# EAGLE design tiny-usb (EAGLE 6.5.0)
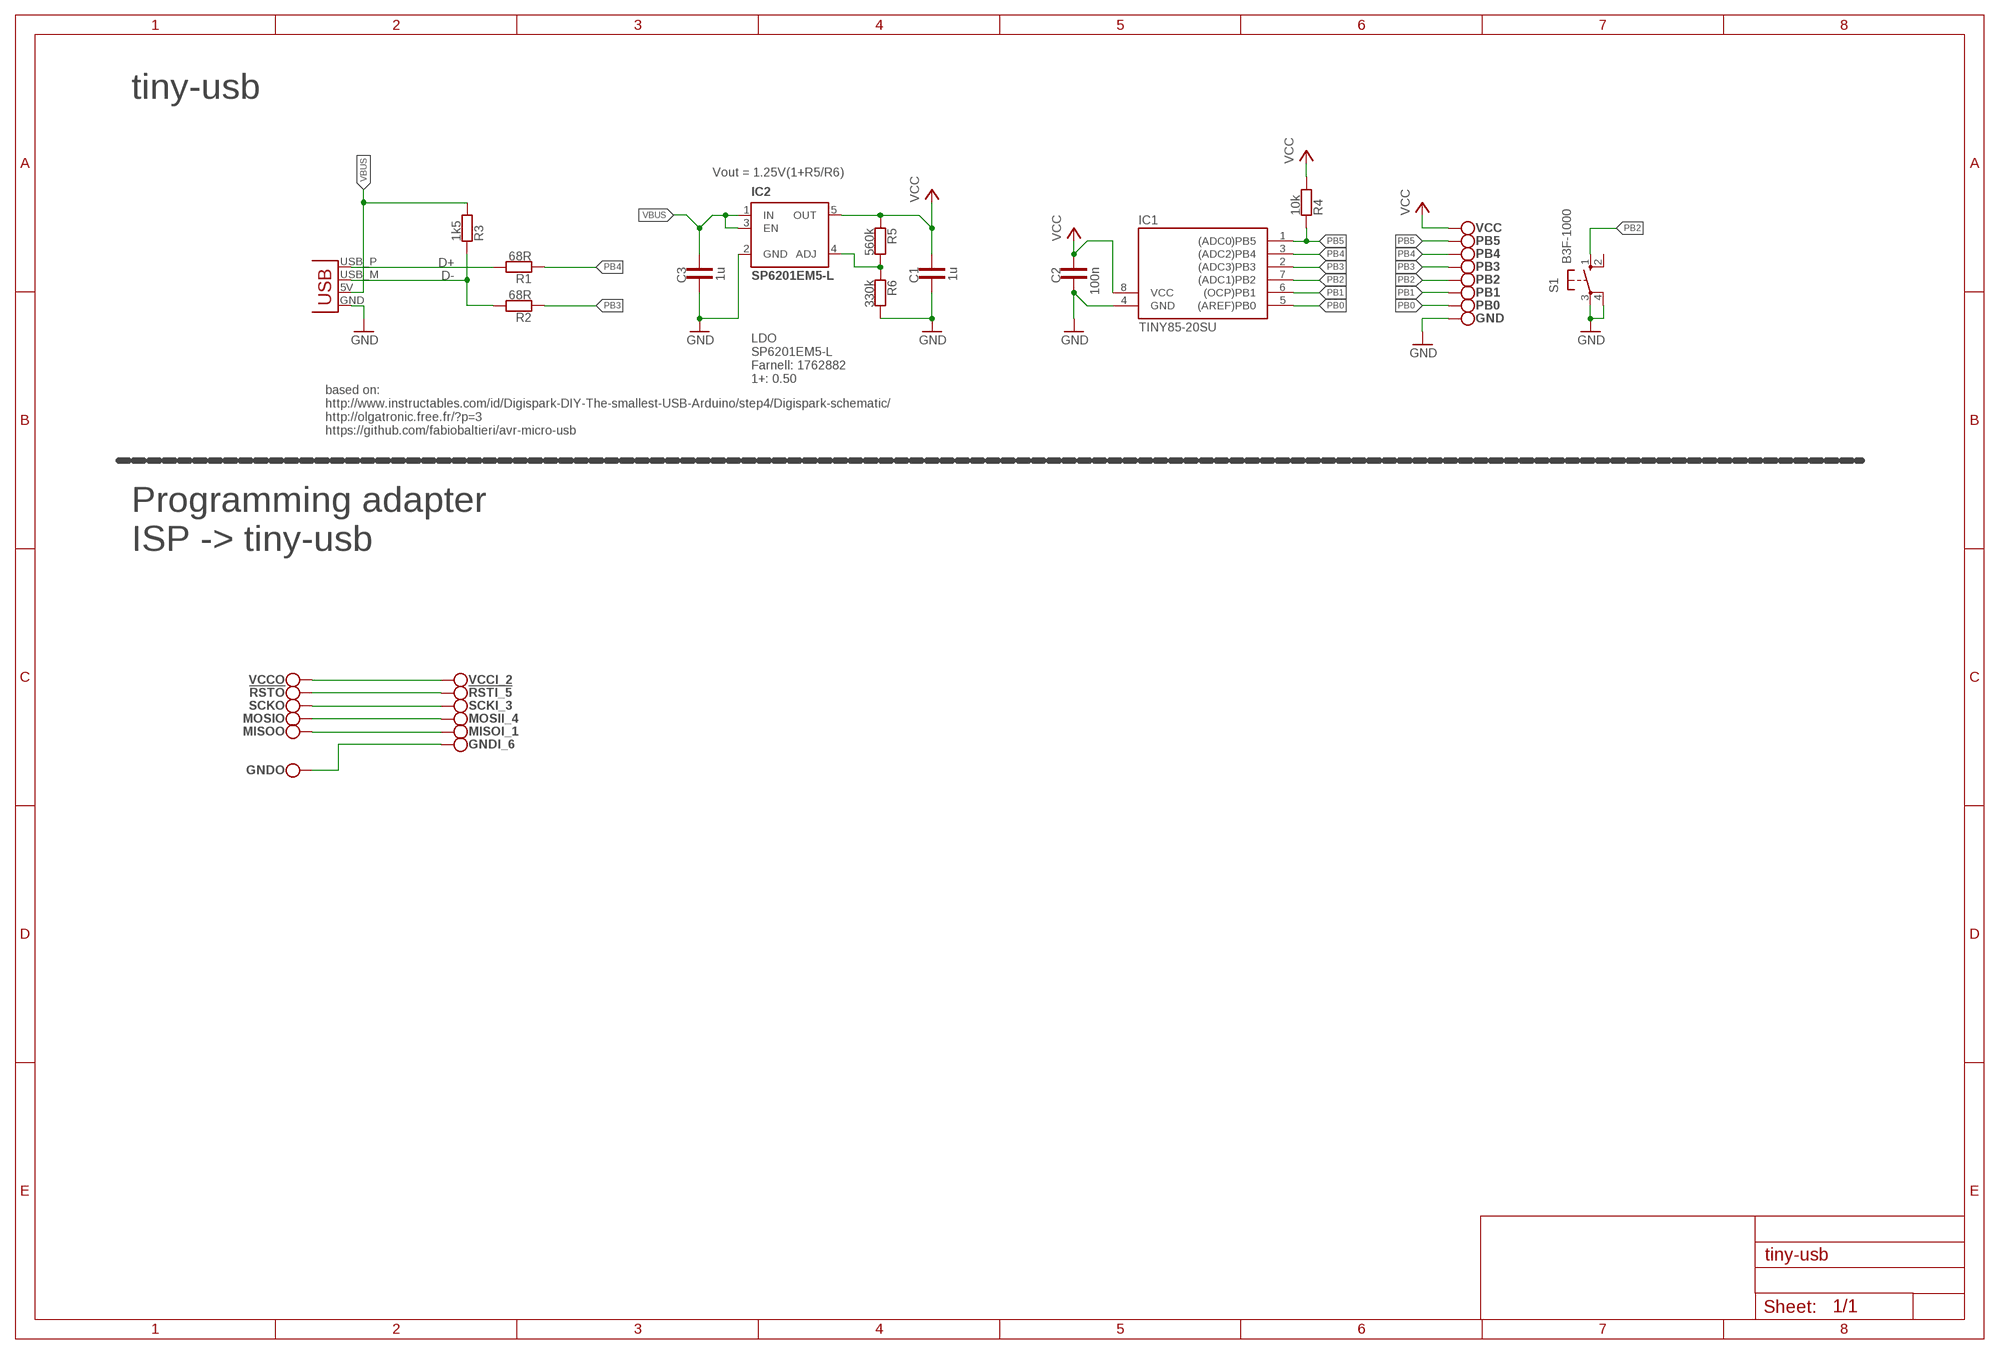
[diagram p0: schematic, sheet 1]

## Parts
!RSTI_5  TP_Q3X1.5MM  [PAD_Q1.5X3MM]
!RSTO  TP_Q3X1.5MM  [PAD_Q1.5X3MM]
C1  1u  C0603  [0603MIL]
C2  100n  C0603  [0603MIL]
C3  1u  C0603  [0603MIL]
GND  TP_Q3X1.5MM  [PAD_Q1.5X3MM]
GNDI_6  TP_Q3X1.5MM  [PAD_Q1.5X3MM]
GNDO  TP_Q3X1.5MM  [PAD_Q1.5X3MM]
IC1  TINY85-20SU  TINY25-20SU  [SOIC8]
IC2  SP6201EM5-L  [SOT23-5]
MISOI_1  TP_Q3X1.5MM  [PAD_Q1.5X3MM]
MISOO  TP_Q3X1.5MM  [PAD_Q1.5X3MM]
MOSII_4  TP_Q3X1.5MM  [PAD_Q1.5X3MM]
MOSIO  TP_Q3X1.5MM  [PAD_Q1.5X3MM]
PB0  TP_Q3X1.5MM  [PAD_Q1.5X3MM]
PB1  TP_Q3X1.5MM  [PAD_Q1.5X3MM]
PB2  TP_Q3X1.5MM  [PAD_Q1.5X3MM]
PB3  TP_Q3X1.5MM  [PAD_Q1.5X3MM]
PB4  TP_Q3X1.5MM  [PAD_Q1.5X3MM]
PB5  TP_Q3X1.5MM  [PAD_Q1.5X3MM]
R1  68R  R0603  [0603MIL]
R2  68R  R0603  [0603MIL]
R3  1k5  R0603  [0603MIL]
R4  10k  R0603  [0603MIL]
R5  560k  R0603  [0603MIL]
R6  330k  R0603  [0603MIL]
S1  B3F-1000  10-XXSMD  [B3F-10SMD]
SCKI_3  TP_Q3X1.5MM  [PAD_Q1.5X3MM]
SCKO  TP_Q3X1.5MM  [PAD_Q1.5X3MM]
VCC  TP_Q3X1.5MM  [PAD_Q1.5X3MM]
VCCI_2  TP_Q3X1.5MM  [PAD_Q1.5X3MM]
VCCO  TP_Q3X1.5MM  [PAD_Q1.5X3MM]
X1  USBPCB  [USB-A-PCB]

## Nets
!ISP_RST: !RSTI_5.1 !RSTO.1
D+: R1.2 X1.USB_P(D+)
D-: R2.2 R3.1 X1.USB_M(D-)
GND: C1.2 C2.2 C3.2 GND.1 IC1.4(GND) IC2.2(GND) R6.2 S1.3(P) S1.4(P1) X1.GND
ISP_GND: GNDI_6.1 GNDO.1
ISP_MISO: MISOI_1.1 MISOO.1
ISP_MOSI: MOSII_4.1 MOSIO.1
ISP_SCK: SCKI_3.1 SCKO.1
ISP_VCC: VCCI_2.1 VCCO.1
N$1: IC2.4(ADJ) R5.2 R6.1
PB0: IC1.5((AREF)PB0) PB0.1
PB1: IC1.6((OCP)PB1) PB1.1
PB2: IC1.7((ADC1)PB2) PB2.1 S1.1(S)
PB3: IC1.2((ADC3)PB3) PB3.1 R2.1
PB4: IC1.3((ADC2)PB4) PB4.1 R1.1
PB5: IC1.1((ADC0)PB5) PB5.1 R4.1
VBUS: C3.1 IC2.1(IN) IC2.3(EN) R3.2 X1.5V(VBUS)
VCC: C1.1 C2.1 IC1.8(VCC) IC2.5(OUT) R4.2 R5.1 VCC.1
Unconnected: S1.2(S1)

## Notes on the sheet
- tiny-usb
- Vout = 1.25V(1+R5/R6)
- LDO
  SP6201EM5-L
  Farnell: 1762882
  1+: 0.50
- based on:
  http://www.instructables.com/id/Digispark-DIY-The-smallest-USB-Arduino/step4/Digispark-schematic/
  http://olgatronic.free.fr/?p=3
  https://github.com/fabiobaltieri/avr-micro-usb
- Programming adapter
  ISP -> tiny-usb

## Library data of the parts
!RSTI_5 !RSTO GND GNDI_6 GNDO MISOI_1 MISOO MOSII_4 MOSIO PB0 PB1-PB5 SCKI_3 SCKO VCC VCCI_2 VCCO = tiny:TP
C1-C3 = tiny:C: C Kondensator im Chip-Gehäuse
IC1 = avr-5:TINY25
IC2 = tiny:SP6201
R1-R6 = tiny:R: R Widerstand im Chip-Gehäuse
S1 = tiny:10-XX: OMRON SWITCH
X1 = sparkfun:USB: USB Connectors USB-B-PTH is fully proven SKU : PRT-00139 USB-miniB is fully proven SKU : PRT-00587 USB-A-PCB is untested. USB-A-H is throughly reviewed, but untested. Spark Fun Electronics SKU : PRT-00437 USB-B-SMT is throughly reviewed, but untested. Needs silkscreen touching up. USB-A-S has not been used/tested USB-MB-H has not been used/tested

## Board
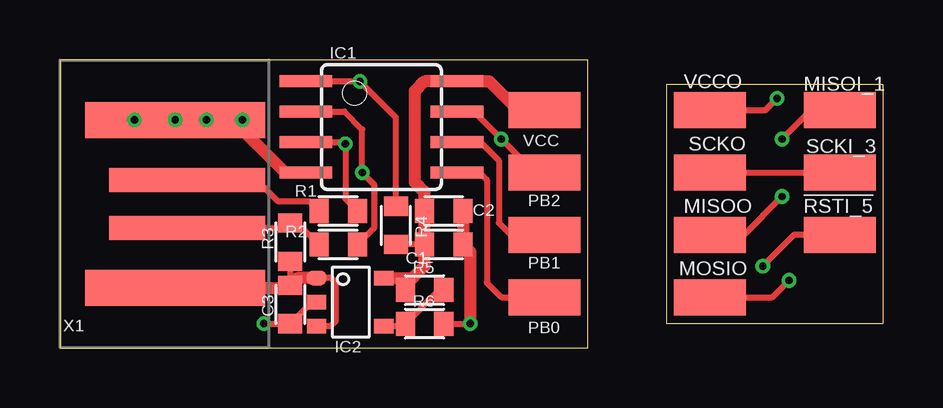
[diagram p1: board, top side]
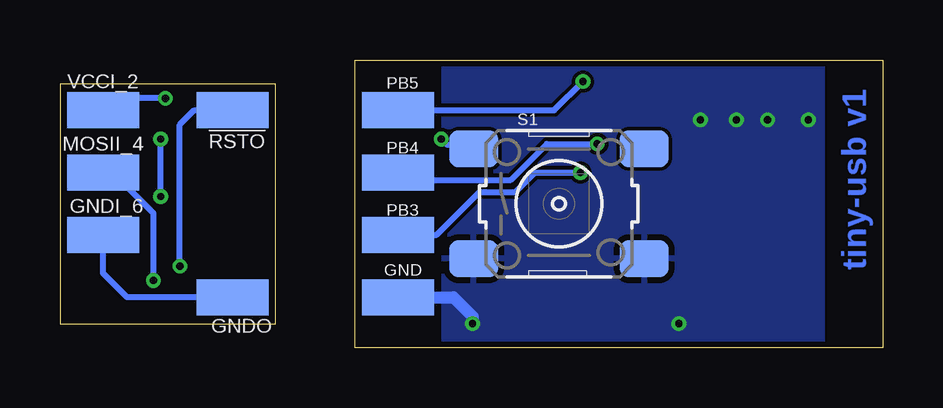
[diagram p2: board, bottom side, seen from below]

Size 34.3 x 12 mm. Coordinates in mm from the lower left corner, seen from the top.
Outline: 0,0 22,0 22,12 0,12 0,0
Outline: 25.3,11 34.3,11 34.3,1 25.3,1 25.3,11
Copper layers (1*16): Top 0.035mm / dielectric 1.5mm / Bottom 0.035mm
Design rules "SeeedStudio_DRU-2layer_no_angle_20130527": minimum track width 6mil, minimum drill 12mil, track to track 6mil, track to pad 6mil, pad to pad 6mil, via to via 6mil, smd to smd 0mil, copper to edge 10mil, drill to drill 10mil, minimum pad ring 10mil, minimum via ring 6mil, stop-mask expansion 2mil, vias tented up to drill 25mil, thermal gap 10mil

### Footprints (pad centres in the part's own frame; a part is rotated, then mirrored left to right if it is on the bottom)
PAD_Q1.5X3MM = smd 3 x 1.5: 1 0,0
0603MIL = smd 0.8 x 1: 1 -0.8,0; 2 0.8,0
SOIC8 = smd 0.5 x 2.2: 1 -1.905,-3.154; 2 -0.645,-3.154; 3 0.625,-3.154; 4 1.895,-3.154; 5 1.905,3.154; 6 0.635,3.154; 7 -0.635,3.154; 8 -1.905,3.154
SOT23-5 = smd 0.8 x 0.6: 1 -1.4,1; 2 -1.4,0; 3 -1.4,-1; 4 1.4,-1; 5 1.4,1
B3F-10SMD = smd 2.032 x 1.524: 1 -3.556,2.286; 2 3.556,2.286; 3 -3.556,-2.286; 4 3.556,-2.286
USB-A-PCB = smd 7.5 x 1.5: 5V -0.2,-3.5; GND -0.2,3.5 | smd 6.5 x 1: USB_M 0.3,-1; USB_P 0.3,1

### Placement (x,y rotation side)
!RSTI_5  32.5,4.7 0 top
!RSTO  27.1,9.9 0 bottom
C1  16,4.3 0 top
C2  16,5.7 0 top
C3  9.6,1.8 270 top
GND  20.2,2.1 0 bottom
GNDI_6  32.5,4.7 0 bottom
GNDO  27.1,2.1 0 bottom
IC1  13.4,9.2 270 top
IC2  12.1,1.9 0 top
MISOI_1  32.5,9.9 0 top
MISOO  27.1,4.7 0 top
MOSII_4  32.5,7.3 0 bottom
MOSIO  27.1,2.1 0 top
PB0  20.2,2.1 0 top
PB1  20.2,4.7 0 top
PB2  20.2,7.3 0 top
PB3  20.2,4.7 0 bottom
PB4  20.2,7.3 0 bottom
PB5  20.2,9.9 0 bottom
R1  11.6,5.7 180 top
R2  11.6,4.3 180 top
R3  9.6,4.4 270 top
R4  14,5.1 270 top
R5  15.2,2.4 0 top
R6  15.2,1 0 top
S1  13.5,6 0 bottom
SCKI_3  32.5,7.3 0 top
SCKO  27.1,7.3 0 top
VCC  20.2,9.9 0 top
VCCI_2  32.5,9.9 0 bottom
VCCO  27.1,9.9 0 top
X1  5,6 0 top

### Tracks (layer width: path | path; a pad name or v marks a point on that pad's centre or on a via)
!ISP_RST  (via drill 0.3)
  Top 0.25: !RSTI_5.1 30.6,4.7 v29.3,3.4
  Bottom 0.25: v29.3,3.4 29.3,9.3 28.7,9.9 !RSTO.1
D+
  Top 0.25: X1.USB_P 8.2,7 9.1,6.1 10.4,6.1 R1.2
D-
  Top 0.25: X1.USB_M 9.6,5 | 9.6,5 10.1,5 R2.2 | R3.1 9.6,5
GND  (via drill 0.3)
  Top 0.25: v8.5,1 C3.2 10.5,1.9 IC2.2 | R6.2 v17.1,1
  Top 0.5: C2.2 C1.2 17.1,4 v17.1,1 | IC1.4 9.39,7.3 7.2,9.5 v6.1,9.5
  Bottom 0.5: GND.1 17.9,2.1 17.1,1.3 v17.1,1
  other vias: 4.8,9.5 3.1,9.5 7.6,9.5
  pour Bottom: 2.5,12 18.3,12 18.3,0 2.5,0
ISP_GND
  Bottom 0.25: GNDO.1 31.5,2.1 32.5,3.1 GNDI_6.1
ISP_MISO  (via drill 0.3)
  Top 0.25: MISOO.1 28.5,4.7 v30.1,6.3 | v30.1,8.7 31.3,9.9 MISOI_1.1
  Bottom 0.25: v30.1,6.3 v30.1,8.7
ISP_MOSI  (via drill 0.3)
  Top 0.25: MOSIO.1 29.7,2.1 v30.4,2.8
  Bottom 0.25: v30.4,2.8 30.4,5.6 32.1,7.3 MOSII_4.1
ISP_SCK
  Top 0.25: SCKO.1 SCKI_3.1
ISP_VCC  (via drill 0.3)
  Top 0.25: VCCO.1 29.4,9.9 v29.9,10.4
  Bottom 0.25: v29.9,10.4 32,10.4 VCCI_2.1
N$1
  Top 0.25: IC2.4 14.3,0.9 R6.1 15.8,2.4 R5.2
PB0
  Top 0.25: PB0.1 18.4,2.1 17.8,2.7 17.8,7 17.5,7.29 IC1.5
PB1
  Top 0.25: PB1.1 18.8,4.7 18.3,5.2 18.3,7.8 17.54,8.56 IC1.6
PB2  (via drill 0.3)
  Top 0.25: IC1.7 17.36,9.84 17.36,9.73 v18.4,8.7 19.8,7.3 PB2.1
  Bottom 0.25: S1.1 17.06,8.46 18.16,8.46 v18.4,8.7
PB3  (via drill 0.3)
  Top 0.25: IC1.2 11.86,9.85 12.6,9.1 v12.6,7.3 13.1,6.8 13.1,5 R2.1
  Bottom 0.25: PB3.1 18.6,4.7 16.8,6.5 15.3,6.5 14.5,7.3 v12.6,7.3
PB4  (via drill 0.3)
  Top 0.25: IC1.3 11.82,8.57 v11.9,8.5 11.9,6.2 R1.1
  Bottom 0.25: PB4.1 19.2,7.3 18.9,7 15.5,7 14,8.5 v11.9,8.5
PB5  (via drill 0.3)
  Top 0.25: IC1.1 v12.5,11.1 14,9.6 R4.1
  Bottom 0.25: v12.5,11.11 v12.5,11.1 13.7,9.9 PB5.1
VBUS
  Top 0.25: R3.2 C3.1 | IC2.3 11.3,0.9 11.5,1.1 11.5,2.7 11.3,2.9 IC2.1
  Top 0.5: X1.5V 9.6,2.5 C3.1 9.9,2.9 IC2.1
VCC
  Top 0.25: IC1.8 | C1.1 R4.2 | R5.1 14.4,2.9
  Top 0.5: VCC.1 19.1,9.9 17.89,11.11 IC1.8 15.21,11.11 14.8,10.7 14.8,6.9 15.2,6.5 C2.1 C1.1 15.2,3.4 14.7,2.9 14.4,2.9 IC2.5

### Text on the board
Bottom: tiny-usb v1